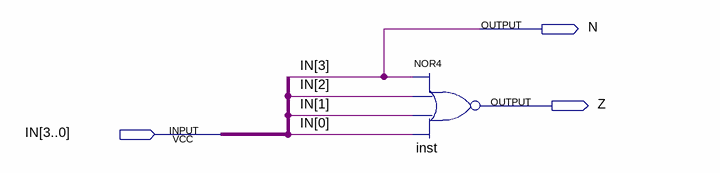
[diagram p0: schematic sheet]
// Quartus schematic Check_NZ.bdf as structural Verilog: 1 symbols, 3 pins
module Check_NZ (
  input  [3:0] IN,
  output N,
  output Z
);

  nor inst (Z, IN[3], IN[2], IN[1], IN[0]);

  assign N = IN[3];
endmodule
